# EAGLE design RGB_i2c_v4plusRTC (EAGLE 9.5.0)
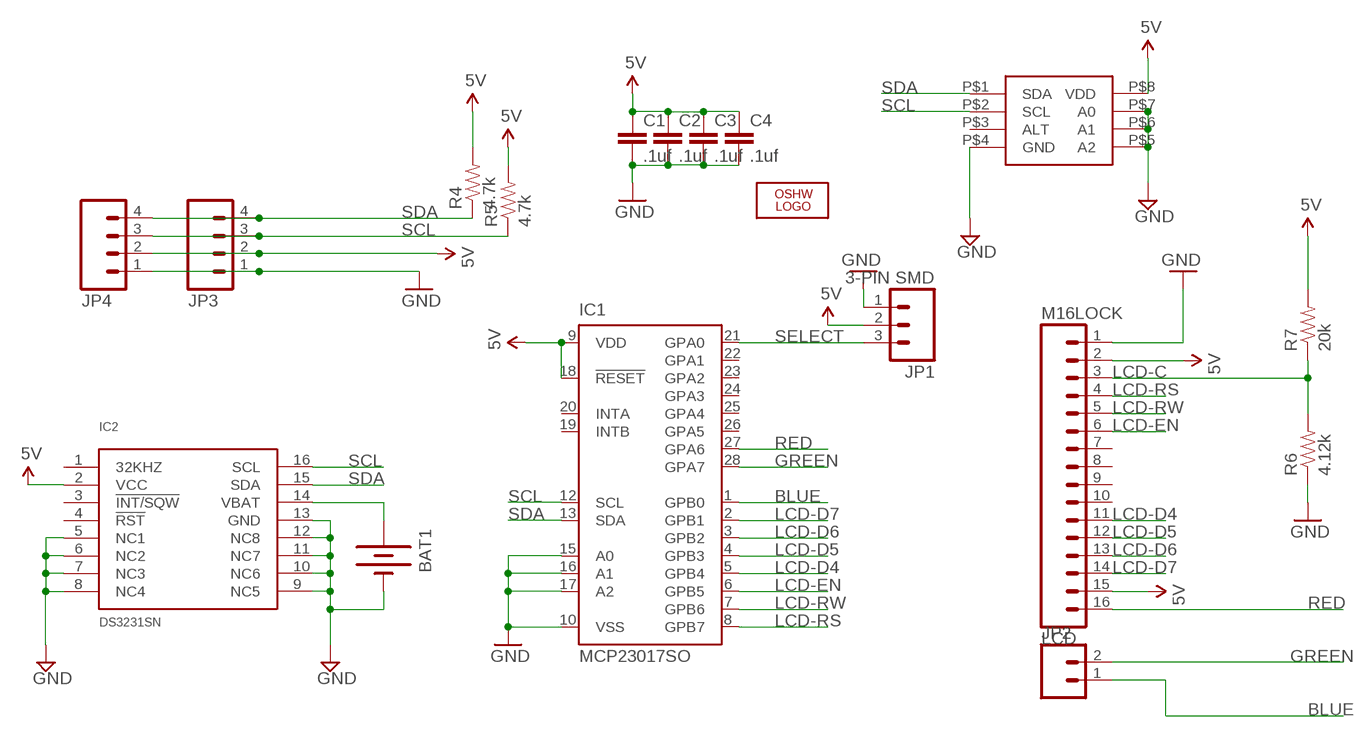
[diagram p0: schematic, sheet 1]

## Parts
BAT1  BATTERY12MM  [BATTCON_12MM]
C1  .1uf  CAP0805  [0805]
C2  .1uf  CAP0805  [0805]
C3  .1uf  CAP0805  [0805]
C4  .1uf  CAP0805  [0805]
IC1  MCP23017SO  [SO28W]
IC2  DS3231SN  [SO16W]
IC3  MCP9808  [MSOP8]
JP1  3-PIN SMD  M03JST-SMD  [JST-3-SMD]
JP2  M02PTH  [1X02]
JP3  M04JST-PTH-VERT  [JST-4-PTH-VERT]
JP4  M04JST-PTH-VERT  [JST-4-PTH-VERT]
LCD  M16LOCK  [1X16_LOCK]
LOGO2  OSHW_LOGO_10MILX0350-NT  [OSHW_10X350_NOTEXT]
R4  4.7k  RESISTOR0805-RES  [0805]
R5  4.7k  RESISTOR0805-RES  [0805]
R6  4.12k  RESISTOR0805-RES  [0805]
R7  20k  RESISTOR0805-RES  [0805]

## Nets
5V: C1.1 C2.1 C3.1 C4.1 IC1.9(VDD) IC1.18(!RESET) IC2.2(VCC) IC3.P$8(VDD) JP1.2 JP3.2 JP4.2 LCD.2 LCD.15 R4.2 R5.2 R7.2
BLUE: IC1.1(GPB0) JP2.1
GND: BAT1.GND(-) C1.2 C2.2 C3.2 C4.2 IC1.10(VSS) IC1.15(A0) IC1.16(A1) IC1.17(A2) IC2.5(NC1) IC2.6(NC2) IC2.7(NC3) IC2.8(NC4) IC2.9(NC5) IC2.10(NC6) IC2.11(NC7) IC2.12(NC8) IC2.13(GND) IC3.P$4(GND) IC3.P$5(A2) IC3.P$6(A1) IC3.P$7(A0) JP1.1 JP3.1 JP4.1 LCD.1 R6.1
GREEN: IC1.28(GPA7) JP2.2
LCD-C: LCD.3 R6.2 R7.1
LCD-D4: IC1.5(GPB4) LCD.11
LCD-D5: IC1.4(GPB3) LCD.12
LCD-D6: IC1.3(GPB2) LCD.13
LCD-D7: IC1.2(GPB1) LCD.14
LCD-EN: IC1.6(GPB5) LCD.6
LCD-RS: IC1.8(GPB7) LCD.4
LCD-RW: IC1.7(GPB6) LCD.5
N$3: BAT1.PWR@1(+) IC2.14(VBAT)
RED: IC1.27(GPA6) LCD.16
SCL: IC1.12(SCL) IC2.16(SCL) IC3.P$2(SCL) JP3.3 JP4.3 R5.1
SDA: IC1.13(SDA) IC2.15(SDA) IC3.P$1(SDA) JP3.4 JP4.4 R4.1
SELECT: IC1.21(GPA0) JP1.3
Unconnected: IC1.19(INTB) IC1.20(INTA) IC1.22(GPA1) IC1.23(GPA2) IC1.24(GPA3) IC1.25(GPA4) IC1.26(GPA5) IC2.1(32KHZ) IC2.3(!INT/SQW) IC2.4(!RST) IC3.P$3(ALT) LCD.7 LCD.8 LCD.9 LCD.10

## Library data of the parts
BAT1 = SparkFun:BATTERY: Battery Holders Various common sizes : AA, AAA, 20mm coin cell and 12mm coin cell.
C1-C4 = SparkFun:CAP: Capacitor Standard 0603 ceramic capacitor, and 0.1" leaded capacitor.
IC1 = adafruit:MCP23017: http://ww1.microchip.com/downloads/en/DeviceDoc/21952a.pdf Source: http://ww1.microchip.com/downloads/en/DeviceDoc/21952a.pdf
IC2 = comfile:DS3231SN
IC3 = OpenEVSE:MCP9808
JP1 = SparkFun-Connectors:M03: Header 3 Standard 3-pin 0.1" header. Use with straight break away headers (SKU : PRT-00116), right angle break away headers (PRT-00553), swiss pins (PRT-00743), machine pins (PRT-00117), and female headers (PRT-00115). Molex polarized connector foot print use with SKU : PRT-08232 with associated crimp pins and housings.; PROD_ID: CONN-12591
JP2 = SparkFun:M02: Header 2 Standard 2-pin 0.1" header. Use with straight break away headers (SKU : PRT-00116), right angle break away headers (PRT-00553), swiss pins (PRT-00743), machine pins (PRT-00117), and female headers (PRT-00115). Molex polarized connector foot print use with SKU : PRT-08233 with associated crimp pins and housings.
JP3 JP4 = SparkFun-Connectors:M04: Header 4 Standard 4-pin 0.1" header. Use with straight break away headers (SKU : PRT-00116), right angle break away headers (PRT-00553), swiss pins (PRT-00743), machine pins (PRT-00117), and female headers (PRT-00115). Molex polarized connector foot print use with SKU : PRT-08231 with associated crimp pins and housings. 1MM SMD Version SKU: PRT-10208
LCD = SparkFun:M16
LOGO2 = ohw-logo:OSHW_LOGO_10MIL
R4-R7 = SparkFun:RESISTOR: Resistor Basic schematic elements and footprints for 0603, 1206, and PTH resistors.

## Board
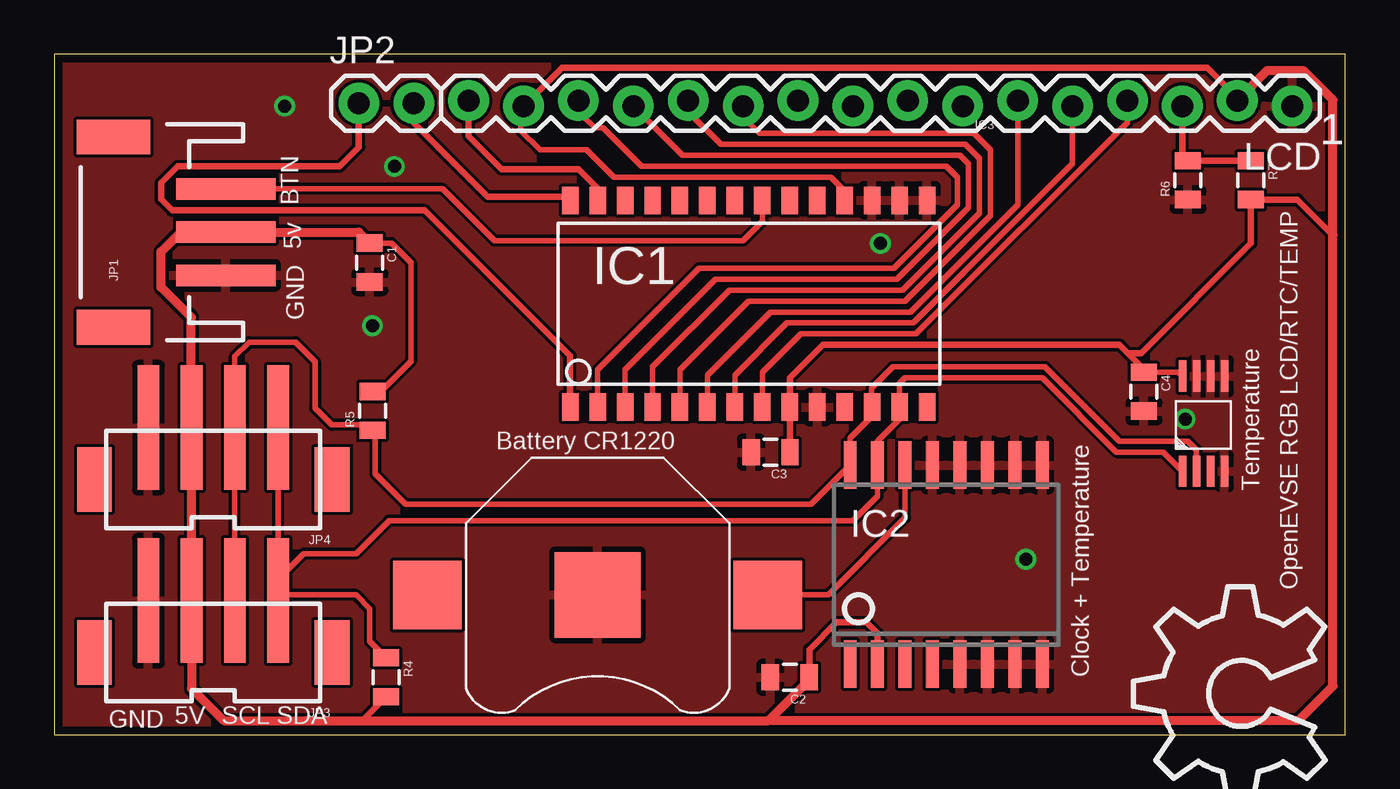
[diagram p1: board, top side]
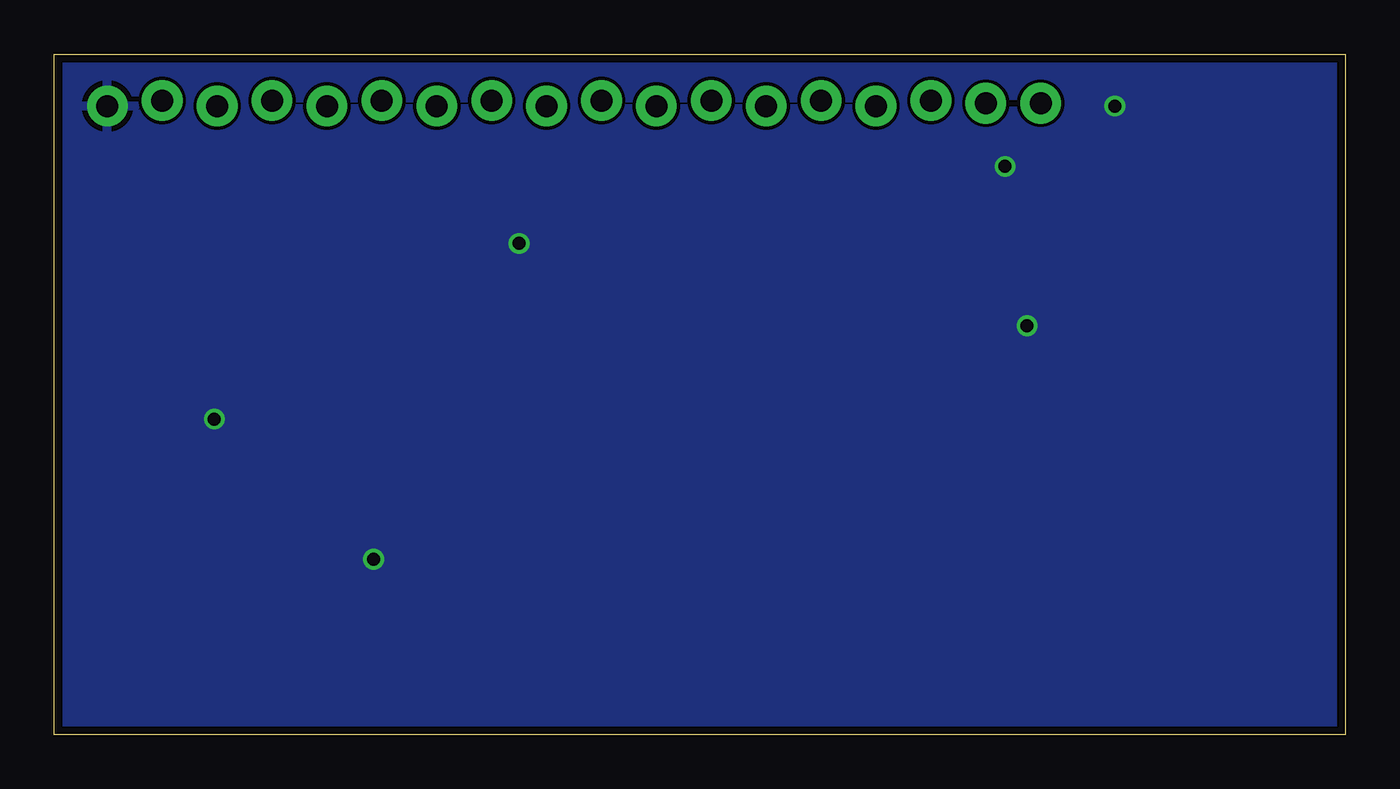
[diagram p2: board, bottom side, seen from below]

Size 59.74 x 31.49 mm. Coordinates in mm from the lower left corner, seen from the top.
Outline: 0,0 59.74,0 59.74,31.49 0,31.49 0,0
Copper layers (1*16): Top 0.0356mm / dielectric 1.5011mm / Bottom 0.0356mm
Design rules "default": minimum track width 6mil, minimum drill 13mil, track to track 6mil, track to pad 6mil, pad to pad 6mil, via to via 6mil, smd to smd 6mil, copper to edge 15mil, drill to drill 6mil, minimum pad ring 7mil, minimum via ring 7mil, stop-mask expansion 4mil, vias tented up to drill 0mil, thermal gap 10mil

### Footprints (pad centres in the part's own frame; a part is rotated, then mirrored left to right if it is on the bottom)
BATTCON_12MM = smd 3.962 x 3.962: GND 0,0 | smd 3.175 x 3.175: PWR@1 -7.874,0; PWR@2 7.874,0
0805 = smd 0.8 x 1.2: 1 -0.9,0; 2 0.9,0
SO28W = smd 0.762 x 1.27: 1 -7.62,-4.78; 2 -6.35,-4.78; 3 -5.08,-4.78; 4 -3.81,-4.78; 5 -2.54,-4.78; 6 -1.27,-4.78; 7 0,-4.78; 8 1.27,-4.78; 9 2.54,-4.78; 10 3.81,-4.78; 11 5.08,-4.78; 12 6.35,-4.78; 13 7.62,-4.78; 14 8.89,-4.78; 15 8.89,4.78; 16 7.62,4.78; 17 6.35,4.78; 18 5.08,4.78; 19 3.81,4.78; 20 2.54,4.78; 21 1.27,4.78; 22 0,4.78; 23 -1.27,4.78; 24 -2.54,4.78; 25 -3.81,4.78; 26 -5.08,4.78; 27 -6.35,4.78; 28 -7.62,4.78
SO16W = smd 0.6 x 2.2: 1 -4.445,-4.6; 2 -3.175,-4.6; 3 -1.905,-4.6; 4 -0.635,-4.6; 5 0.635,-4.6; 6 1.905,-4.6; 7 3.175,-4.6; 8 4.445,-4.6; 9 4.445,4.6; 10 3.175,4.6; 11 1.905,4.6; 12 0.635,4.6; 13 -0.635,4.6; 14 -1.905,4.6; 15 -3.175,4.6; 16 -4.445,4.6
MSOP8 = smd 0.35 x 1.45: P$1 0,0; P$2 0.65,0; P$3 1.3,0; P$4 1.95,0; P$5 1.95,4.4; P$6 1.3,4.4; P$7 0.65,4.4; P$8 0,4.4
JST-3-SMD = smd 1 x 4.6: 1 -1.99,-4.77; 2 0.01,-4.77; 3 2.01,-4.77 | smd 1.6 x 3.4: NC1 -4.39,0.43; NC2 4.41,0.43
1X02 = drill 1.016 pad 1.88: 1 0,0; 2 2.54,0
JST-4-PTH-VERT = smd 1 x 5.75: 1 -3,2.4; 2 -1,2.4; 3 1,2.4; 4 3,2.4 | smd 1.6 x 3: P$1 -5.5,0; P$2 5.5,0
1X16_LOCK = drill 1.016 pad 1.88: 1 0,0.127; 2 2.54,-0.127; 3 5.08,0.127; 4 7.62,-0.127; 5 10.16,0.127; 6 12.7,-0.127; 7 15.24,0.127; 8 17.78,-0.127; 9 20.32,0.127; 10 22.86,-0.127; 11 25.4,0.127; 12 27.94,-0.127; 13 30.48,0.127; 14 33.02,-0.127; 15 35.56,0.127; 16 38.1,-0.127

### Placement (x,y rotation side)
BAT1  25.15,6.48 180 top
C1  14.61,21.84 270 top
C2  34.04,2.67 180 top
C3  33.15,13.08 180 top
C4  50.42,15.88 270 top
IC1  31.5,19.94 0 top
IC2  41.28,7.87 0 top
IC3  52.2,12.19 0 top
JP1  3.18,23.24 90 top
JP2  14.1,29.21 0 top
JP3  7.37,3.81 0 top
JP4  7.37,11.81 0 top
LCD  57.28,29.21 180 top
LOGO2  58.8,-3.05 90 top  (outside the outline)
R4  15.37,2.67 270 top
R5  14.73,14.99 90 top
R6  52.45,25.65 90 top
R7  55.37,25.65 270 top

### Tracks (layer width: path | path; a pad name or v marks a point on that pad's centre or on a via)
5V
  Top 0.254: IC1.18 36.58,25.15 35.94,25.78 25.91,25.78 24.64,27.05 22.48,27.05 21.59,27.94 21.59,28.96 LCD.15 | C4.1 52.01,16.77 IC3.P$8 | C1.1 15.61,22.74 16.51,21.84 16.51,17.27 15.12,15.89 R5.2
  Top 0.305: 34.92,2.54 34.92,2.66 C2.1 34.94,3.95 36.2,5.21 37.59,5.21 38.1,4.7 IC2.2 | 49.67,17.65 50.29,17.65 55.37,22.73 R7.2 57.52,24.75 59.16,23.11 | C3.1 34.05,15.15 IC1.9 34.04,16.51 35.56,18.03 49.29,18.03 49.67,17.65 | R4.2 14.26,0.66 11.68,0.66 | LCD.15 23.5,30.86 53.34,30.86 54.74,29.46 LCD.2 | C4.1 50.42,16.9 49.67,17.65
  Top 0.406: 33.04,0.66 11.68,0.66 7.85,0.66 6.37,2.14 JP3.2 JP4.2 6.35,14.23 6.35,19.3 4.95,20.7 4.95,22.35 5.85,23.25 JP1.2 14.1,23.25 C1.1 | 33.04,0.66 34.92,2.54 | LCD.2 56.13,30.73 57.78,30.73 59.16,29.36 59.16,23.11 59.16,2.26 57.55,0.66 33.04,0.66
BLUE
  Top 0.305: IC1.1 23.88,17.53 17.14,24.26 5.46,24.26 4.95,24.77 4.95,25.53 5.71,26.29 13.21,26.29 14.1,27.18 JP2.1
GND  (via drill 0.6)
  other vias: 38.23,22.73 14.73,18.92 44.96,8.13 10.67,29.08 15.75,26.29 52.32,14.61
  pour Top: -10.41,-4.39 63.75,-4.06 63.5,35.18 -10.54,34.68
  pour Bottom: -8.66,-2.16 61.85,-2.16 61.98,33.53 -8.15,33.19
GREEN
  Top 0.305: JP2.2 16.64,28.32 20.07,24.89 23.7,24.89 IC1.28
LCD-C
  Top 0.305: R7.1 R6.2 52.2,26.81 LCD.3
LCD-D4
  Top 0.254: IC1.5 28.96,16.89 32.13,20.07 39.37,20.07 43.31,24 43.31,27.05 42.55,27.81 32.64,27.81 31.88,28.57 LCD.11
LCD-D5
  Top 0.254: LCD.12 29.34,28.83 30.86,27.3 42.16,27.3 42.8,26.67 42.8,24.13 39.24,20.57 31.24,20.57 27.69,17.02 IC1.4
LCD-D6
  Top 0.254: LCD.13 29.08,26.8 41.91,26.8 42.29,26.42 42.29,24.38 38.99,21.08 30.61,21.08 26.42,16.89 IC1.3
LCD-D7
  Top 0.254: LCD.14 24.51,29.08 24.51,28.57 25.02,28.07 25.4,28.07 27.18,26.29 41.28,26.29 41.78,25.78 41.78,24.51 38.86,21.59 29.85,21.59 25.15,16.89 IC1.2
LCD-EN
  Top 0.254: LCD.6 44.58,24.51 39.62,19.56 33.15,19.56 30.23,16.64 IC1.6
LCD-RS
  Top 0.254: LCD.4 49.66,28.32 39.88,18.54 34.54,18.54 32.77,16.76 IC1.8
LCD-RW
  Top 0.254: LCD.5 47.12,26.42 39.75,19.05 33.91,19.05 31.5,16.64 IC1.7
N$3
  Top 0.254: BAT1.PWR@1 35.81,6.48 39.37,10.03 IC2.14
RED
  Top 0.305: IC1.27 25.15,25.27 24.26,26.16 20.7,26.16 19.18,27.69 LCD.16
SCL
  Top 0.254: IC3.P$2 52.85,13.19 52.45,13.59 49.28,13.59 45.85,17.02 38.8,17.02 37.82,16.04 37.82,15.18 IC1.12 37.85,14.73 36.83,13.72 IC2.16 35.02,10.67 16.27,10.67 14.86,12.08 14.86,13.96 R5.1 14.48,14.34 12.85,14.34 12.08,15.11 12.08,17.26 11.18,18.16 9.02,18.16 8.37,17.51 JP4.3 JP3.3
SDA
  Top 0.254: IC3.P$1 51.31,13.08 49.15,13.08 45.72,16.51 39.37,16.51 39.12,16.26 IC1.13 39.12,14.61 38.1,13.59 IC2.15 38.1,11.05 36.96,9.91 15.49,9.91 13.97,8.38 11.56,8.38 10.37,7.19 | JP3.4 10.37,6.35 | 10.37,7.19 JP4.4 | 10.37,6.35 10.49,6.48 13.97,6.48 14.61,5.84 14.61,4.33 R4.1 | 10.37,7.19 10.37,6.35
SELECT
  Top 0.254: IC1.21 32.77,23.75 31.88,22.86 20.37,22.86 17.98,25.25 JP1.3

### Text on the board
tPlace: Battery CR1220 | Temperature | Clock + Temperature
tNames: 1 | BTN | 5v | GND | OpenEVSE RGB LCD/RTC/TEMP | GND | 5V | SCL | SDA